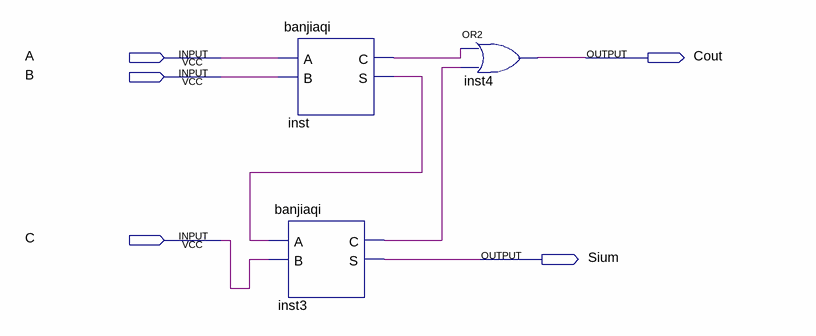
[diagram p0: schematic sheet]
// Quartus schematic fullfadder.bdf as structural Verilog: 3 symbols, 5 pins
module fullfadder (
  input  A,
  input  B,
  input  C,
  output Cout,
  output Sium
);

  wire inst3_c, inst_c, inst_s;

  banjiaqi inst (.A(A), .B(B), .C(inst_c), .S(inst_s));
  banjiaqi inst3 (.A(inst_s), .B(C), .C(inst3_c), .S(Sium));
  or inst4 (Cout, inst_c, inst3_c);
endmodule
